# EAGLE design RobotBoard4 (EAGLE 6.5.0)
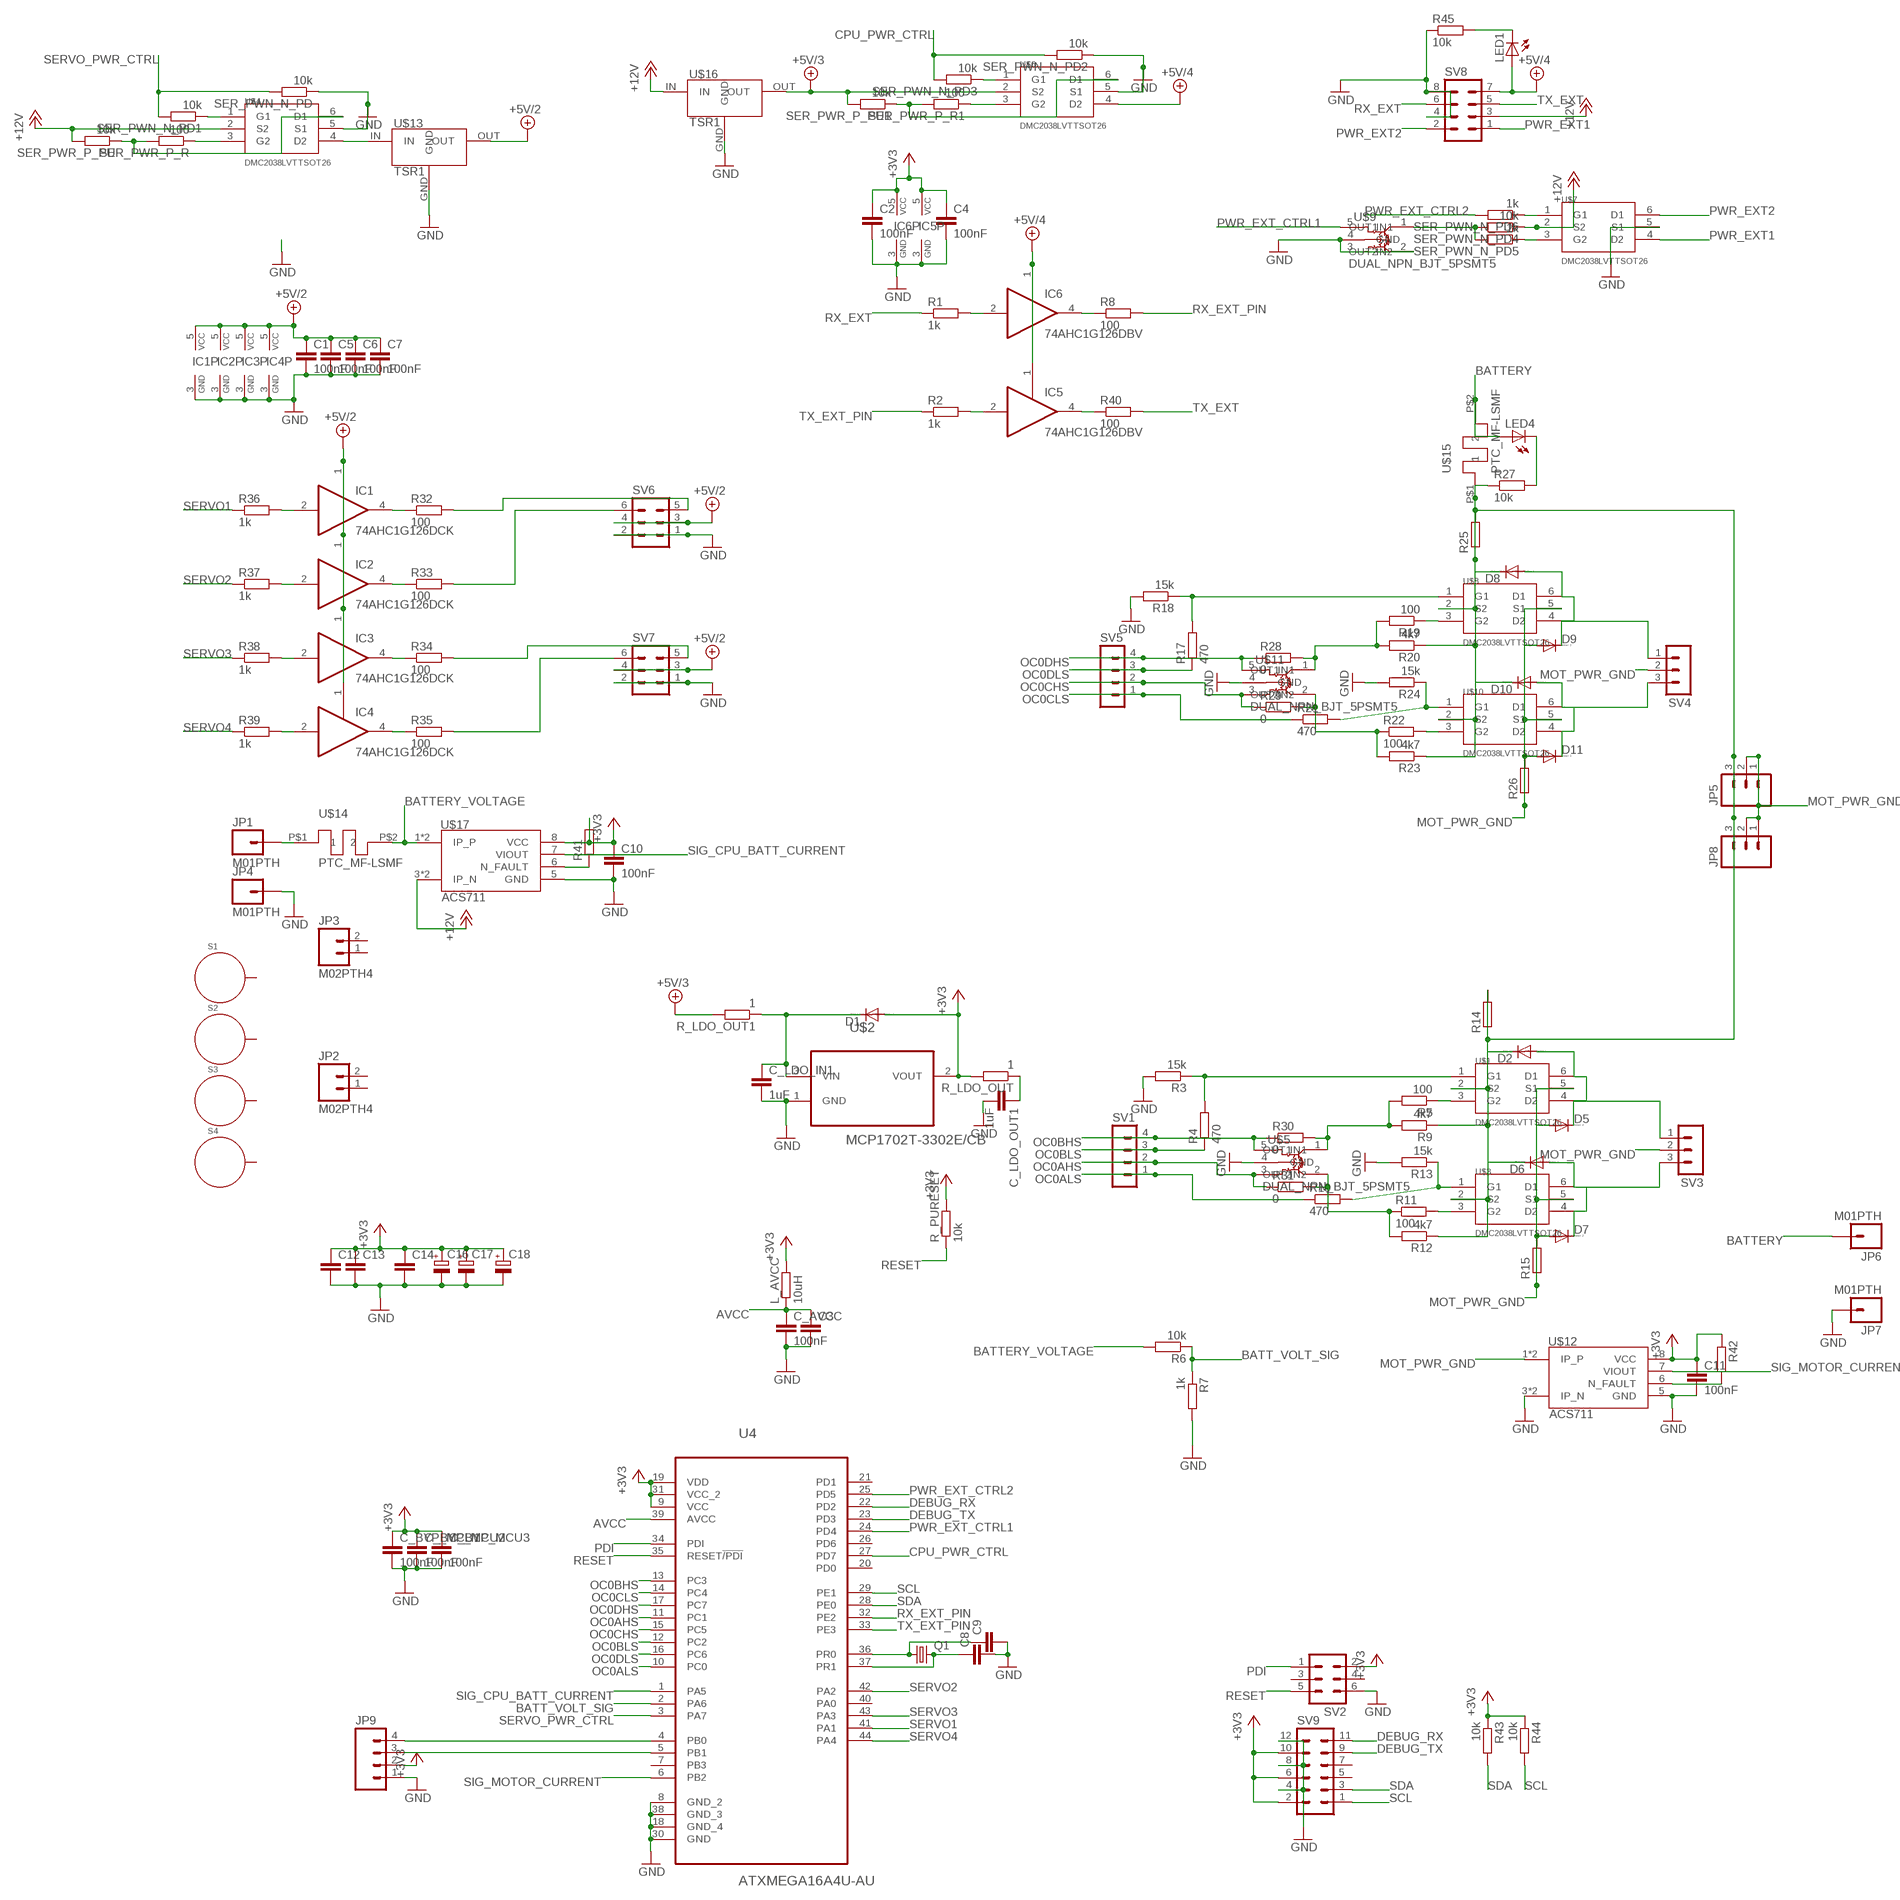
[diagram p0: schematic, sheet 1]

## Parts
C1  100nF  C-EUC0603  [C0603]
C2  100nF  C-EUC0603K  [C0603K]
C3  C-EUC1206K  [C1206K]
C4  100nF  C-EUC0603K  [C0603K]
C5  100nF  C-EUC0603  [C0603]
C6  100nF  C-EUC0603  [C0603]
C7  100nF  C-EUC0603  [C0603]
C8  C-EUC0603K  [C0603K]
C9  C-EUC0603K  [C0603K]
C10  100nF  C-EUC0603K  [C0603K]
C11  100nF  C-EUC0603K  [C0603K]
C12  C-EUC0805K  [C0805K]
C13  C-EUC0805K  [C0805K]
C14  C-EUC1210  [C1210]
C16  CPOL-EUE2.5-6  [E2,5-6]
C17  CPOL-EUE2.5-6  [E2,5-6]
C18  CPOL-EU153CLV-0505  [153CLV-0505]
C_AVCC  100nF  C-EUC0603  [C0603]
C_BYP_MCU1  100nF  C-EUC0603  [C0603]
C_BYP_MCU2  100nF  C-EUC0603  [C0603]
C_BYP_MCU3  100nF  C-EUC0603  [C0603]
C_LDO_IN1  1uF  C-EUC0805  [C0805]
C_LDO_OUT1  1uF  C-EUC0805  [C0805]
D1  DIODE-SOD523  [SOD523]
D2  DIODE-SOD123  [SOD123]
D5  DIODE-SOD123  [SOD123]
D6  DIODE-SOD123  [SOD123]
D7  DIODE-SOD123  [SOD123]
D8  DIODE-SOD123  [SOD123]
D9  DIODE-SOD123  [SOD123]
D10  DIODE-SOD123  [SOD123]
D11  DIODE-SOD123  [SOD123]
IC1  74AHC1G126DCK  [SC70-5]
IC2  74AHC1G126DCK  [SC70-5]
IC3  74AHC1G126DCK  [SC70-5]
IC4  74AHC1G126DCK  [SC70-5]
IC5  74AHC1G126DBV  [SOT23-5]
IC6  74AHC1G126DBV  [SOT23-5]
JP1  M01PTH  [1X01]
JP2  M02PTH4  [1X02_XTRA_BIG]
JP3  M02PTH4  [1X02_XTRA_BIG]
JP4  M01PTH  [1X01]
JP5  M03PTH  [1X03]
JP6  M01PTH  [1X01]
JP7  M01PTH  [1X01]
JP8  M03PTH  [1X03]
JP9  M04PTH  [1X04]
L_AVCC  10uH  R-EU_R0805  [R0805]
LED1  LEDSML0603  [SML0603]
LED4  LEDSML0603  [SML0603]
Q1  CRYSTALHC49S  [HC49/S]
R1  1k  R-EU_R0603  [R0603]
R2  1k  R-EU_R0603  [R0603]
R3  15k  R-EU_R0603  [R0603]
R4  470  R-EU_R0603  [R0603]
R5  100  R-EU_R0603  [R0603]
R6  10k  R-EU_R0603  [R0603]
R7  1k  R-EU_R0603  [R0603]
R8  100  R-EU_R0603  [R0603]
R9  4k7  R-EU_R0603  [R0603]
R10  470  R-EU_R0603  [R0603]
R11  100  R-EU_R0603  [R0603]
R12  4k7  R-EU_R0603  [R0603]
R13  15k  R-EU_R0603  [R0603]
R14  R-EU_0204/5  [0204/5]
R15  R-EU_0204/5  [0204/5]
R17  470  R-EU_R0603  [R0603]
R18  15k  R-EU_R0603  [R0603]
R19  100  R-EU_R0603  [R0603]
R20  4k7  R-EU_R0603  [R0603]
R21  470  R-EU_R0603  [R0603]
R22  100  R-EU_R0603  [R0603]
R23  4k7  R-EU_R0603  [R0603]
R24  15k  R-EU_R0603  [R0603]
R25  R-EU_0204/5  [0204/5]
R26  R-EU_0204/5  [0204/5]
R27  10k  R-EU_R0603  [R0603]
R28  0  R-EU_R0603  [R0603]
R29  0  R-EU_R0603  [R0603]
R30  0  R-EU_R0603  [R0603]
R31  0  R-EU_R0603  [R0603]
R32  100  R-EU_R0603  [R0603]
R33  100  R-EU_R0603  [R0603]
R34  100  R-EU_R0603  [R0603]
R35  100  R-EU_R0603  [R0603]
R36  1k  R-EU_R0603  [R0603]
R37  1k  R-EU_R0603  [R0603]
R38  1k  R-EU_R0603  [R0603]
R39  1k  R-EU_R0603  [R0603]
R40  100  R-EU_R0603  [R0603]
R41  R-EU_R0603  [R0603]
R42  R-EU_R0603  [R0603]
R43  10k  R-EU_R0603  [R0603]
R44  10k  R-EU_R0603  [R0603]
R45  10k  R-EU_R0603  [R0603]
R_LDO_OUT  1  R-EU_R0603  [R0603]
R_LDO_OUT1  1  R-EU_R0603  [R0603]
R_PURESET  10k  R-EU_R0603  [R0603]
S1  STANDOFF_ELECTRICAL  [STANDOFF-ELECTRICAL]
S2  STANDOFF_ELECTRICAL  [STANDOFF-ELECTRICAL]
S3  STANDOFF_ELECTRICAL  [STANDOFF-ELECTRICAL]
S4  STANDOFF_ELECTRICAL  [STANDOFF-ELECTRICAL]
SER_PWN_N_PD  10k  R-EU_R0603  [R0603]
SER_PWN_N_PD1  10k  R-EU_R0603  [R0603]
SER_PWN_N_PD2  10k  R-EU_R0603  [R0603]
SER_PWN_N_PD3  10k  R-EU_R0603  [R0603]
SER_PWN_N_PD4  10k  R-EU_R0603  [R0603]
SER_PWN_N_PD5  1k  R-EU_R0603  [R0603]
SER_PWN_N_PD6  1k  R-EU_R0603  [R0603]
SER_PWR_P_PU  10k  R-EU_R0603  [R0603]
SER_PWR_P_PU1  10k  R-EU_R0603  [R0603]
SER_PWR_P_R  100  R-EU_R0603  [R0603]
SER_PWR_P_R1  100  R-EU_R0603  [R0603]
SV1  MA04-1  [MA04-1]
SV2  MA03-2  [MA03-2]
SV3  MA03-1  [MA03-1]
SV4  MA03-1  [MA03-1]
SV5  MA04-1  [MA04-1]
SV6  MA03-2  [MA03-2]
SV7  MA03-2  [MA03-2]
SV8  MA04-2  [MA04-2]
SV9  MA06-2  [MA06-2]
U4  ATXMEGA16A4U-AU  [QFP80P1200X1200X120-44N]
U$1  DMC2038LVTTSOT26  [TSOT26]
U$2  MCP1702T-3302E/CB  [SOT95P255X145-3N]
U$3  DMC2038LVTTSOT26  [TSOT26]
U$4  DMC2038LVTTSOT26  [TSOT26]
U$5  DUAL_NPN_BJT_5PSMT5  [SC-74A]
U$6  DMC2038LVTTSOT26  [TSOT26]
U$7  DMC2038LVTTSOT26  [TSOT26]
U$8  DMC2038LVTTSOT26  [TSOT26]
U$9  DUAL_NPN_BJT_5PSMT5  [SC-74A]
U$10  DMC2038LVTTSOT26  [TSOT26]
U$11  DUAL_NPN_BJT_5PSMT5  [SC-74A]
U$12  ACS711  [SO08]
U$13  TSR1  [TSR-1]
U$14  PTC_MF-LSMF  [PTC_FUSE_BOURNS]
U$15  PTC_MF-LSMF  [PTC_FUSE_BOURNS]
U$16  TSR1  [TSR-1]
U$17  ACS711  [SO08]

## Nets
+3V3: C2.1 C4.1 C10.1 C11.1 C12.1 C13.1 C14.1 C16.+ C17.+ C18.+ C_BYP_MCU1.1 C_BYP_MCU2.1 C_BYP_MCU3.1 D1.A IC5.5(VCC) IC6.5(VCC) JP9.2 L_AVCC.2 R41.2 R42.1 R43.1 R44.1 R_LDO_OUT.2 R_PURESET.2 SV2.2 SV9.2 SV9.6 SV9.10 U4.9(VCC) U4.19(VDD) U4.31(VCC_2) U$2.2(VOUT) U$12.8(VCC) U$17.8(VCC)
+5V/2: C1.1 C5.1 C6.1 C7.1 IC1.1(OE) IC1.5(VCC) IC2.1(OE) IC2.5(VCC) IC3.1(OE) IC3.5(VCC) IC4.1(OE) IC4.5(VCC) SV6.3 SV6.4 SV7.3 SV7.4 U$13.OUT
+5V/3: R_LDO_OUT1.2 SER_PWR_P_PU1.2 U$6.2(S2) U$16.OUT
+5V/4: IC5.1(OE) IC6.1(OE) LED1.A SV8.7 U$6.4(D2)
+12V: SER_PWN_N_PD4.1 SER_PWR_P_PU.2 SV8.3 U$4.2(S2) U$7.2(S2) U$16.IN U$17.3(IP_N) U$17.4(IP_N)
AVCC: C3.1 C_AVCC.1 L_AVCC.1 U4.39(AVCC)
BATT_VOLT_SIG: R6.1 R7.1 U4.2(PA6)
BATTERY: JP6.1 LED4.A U$15.P$2
BATTERY_VOLTAGE: R6.2 U$14.P$2 U$17.1(IP_P) U$17.2(IP_P)
CPU_PWR_CTRL: SER_PWN_N_PD2.2 SER_PWN_N_PD3.2 U4.27(PD7)
DEBUG_RX: SV9.11 U4.22(PD2)
DEBUG_TX: SV9.9 U4.23(PD3)
GND: C1.2 C2.2 C3.2 C4.2 C5.2 C6.2 C7.2 C8.2 C9.2 C10.2 C11.2 C12.2 C13.2 C14.2 C16.- C17.- C18.- C_AVCC.2 C_BYP_MCU1.2 C_BYP_MCU2.2 C_BYP_MCU3.2 C_LDO_IN1.2 C_LDO_OUT1.2 IC1.3(GND) IC2.3(GND) IC3.3(GND) IC4.3(GND) IC5.3(GND) IC6.3(GND) JP4.1 JP7.1 JP9.1 R3.2 R7.2 R13.2 R18.2 R24.2 R45.1 SER_PWN_N_PD2.1 SER_PWN_N_PD.1 SV2.6 SV6.1 SV6.2 SV7.1 SV7.2 SV8.4 SV8.8 SV9.4 SV9.8 SV9.12 U4.8(GND_2) U4.18(GND_4) U4.30(GND) U4.38(GND_3) U$2.1(GND) U$4.5(S1) U$5.4(GND) U$6.5(S1) U$7.5(S1) U$9.2(OUT2) U$9.3(IN2) U$9.4(GND) U$11.4(GND) U$12.3(IP_N) U$12.4(IP_N) U$12.5(GND) U$13.GND U$16.GND U$17.5(GND)
MOT_PWR_GND: D5.A D7.A D9.A D11.A JP5.1 JP5.2 JP8.1 JP8.2 R15.1 R15.2 R26.1 R26.2 SV3.2 SV4.2 U$1.5(S1) U$3.5(S1) U$8.5(S1) U$10.5(S1) U$12.1(IP_P) U$12.2(IP_P)
N$1: R5.2 R9.2 R30.2 U$5.1(OUT1)
N$2: SER_PWR_P_PU.1 SER_PWR_P_R.2 U$4.6(D1)
N$3: SER_PWR_P_R.1 U$4.3(G2)
N$4: C_LDO_OUT1.1 R_LDO_OUT.1
N$5: JP9.4 U4.4(PB0)
N$6: JP1.1 U$14.P$1
N$7: SER_PWN_N_PD1.1 U$4.1(G1)
N$8: C_LDO_IN1.1 D1.C R_LDO_OUT1.1 U$2.3(VIN)
N$9: SER_PWR_P_PU1.1 SER_PWR_P_R1.2 U$6.6(D1)
N$10: SER_PWR_P_R1.1 U$6.3(G2)
N$11: R11.1 R12.2 R31.2 U$5.2(OUT2)
N$12: R3.1 R4.2 U$1.1(G1)
N$13: R5.1 U$1.3(G2)
N$14: R10.2 R13.1 U$3.1(G1)
N$15: R11.2 U$3.3(G2)
N$16: JP9.3 U4.5(PB1)
N$17: D2.A D5.C SV3.1 U$1.4(D2) U$1.6(D1)
N$18: IC1.4(O) R32.1
N$19: D6.A D7.C SV3.3 U$3.4(D2) U$3.6(D1)
N$20: R17.2 R18.1 U$8.1(G1)
N$21: R19.1 U$8.3(G2)
N$22: R19.2 R20.2 R28.2 U$11.1(OUT1)
N$23: D2.C D6.C D8.C D10.C JP5.3 JP8.3 R9.1 R12.1 R14.1 R14.2 R20.1 R23.1 R25.1 R25.2 R27.1 U$1.2(S2) U$3.2(S2) U$8.2(S2) U$10.2(S2) U$15.P$1
N$24: IC6.2(I) R1.2
N$25: R22.1 R23.2 R29.2 U$11.2(OUT2)
N$26: R21.2 R24.1 U$10.1(G1)
N$27: R22.2 U$10.3(G2)
N$28: LED4.C R27.2
N$29: D8.A D9.C SV4.1 U$8.4(D2) U$8.6(D1)
N$30: D10.A D11.C SV4.3 U$10.4(D2) U$10.6(D1)
N$31: IC2.4(O) R33.1
N$32: IC3.4(O) R34.1
N$33: IC4.4(O) R35.1
N$34: IC1.2(I) R36.2
N$35: IC2.2(I) R37.2
N$36: IC3.2(I) R38.2
N$37: IC4.2(I) R39.2
N$38: R32.2 SV6.5
N$39: R33.2 SV6.6
N$40: R34.2 SV7.5
N$41: R35.2 SV7.6
N$42: SER_PWN_N_PD3.1 U$6.1(G1)
N$43: U$4.4(D2) U$13.IN
N$44: C9.1 Q1.1 U4.36(PR0)
N$45: C8.1 Q1.2 U4.37(PR1)
N$46: IC5.2(I) R2.2
N$47: IC5.4(O) R40.1
N$48: IC6.4(O) R8.1
N$49: R42.2 U$12.6(N_FAULT)
N$50: SER_PWN_N_PD5.1 U$7.3(G2)
N$51: SER_PWN_N_PD4.2 SER_PWN_N_PD5.2 U$9.1(OUT1)
N$52: SER_PWN_N_PD6.1 U$7.1(G1)
N$53: LED1.C R45.2
N$54: R41.1 U$17.6(N_FAULT)
OC0AHS: R31.1 SV1.2 U4.11(PC1) U$5.3(IN2)
OC0ALS: R10.1 SV1.1 U4.10(PC0)
OC0BHS: R30.1 SV1.4 U4.13(PC3) U$5.5(IN1)
OC0BLS: R4.1 SV1.3 U4.12(PC2)
OC0CHS: R29.1 SV5.2 U4.15(PC5) U$11.3(IN2)
OC0CLS: R21.1 SV5.1 U4.14(PC4)
OC0DHS: R28.1 SV5.4 U4.17(PC7) U$11.5(IN1)
OC0DLS: R17.1 SV5.3 U4.16(PC6)
PDI: SV2.1 U4.34(PDI)
PWR_EXT1: SV8.1 U$7.4(D2)
PWR_EXT2: SV8.2 U$7.6(D1)
PWR_EXT_CTRL1: U4.24(PD4) U$9.5(IN1)
PWR_EXT_CTRL2: SER_PWN_N_PD6.2 U4.25(PD5)
RESET: R_PURESET.1 SV2.5 U4.35(RESET!/PDI)
RX_EXT: R1.1 SV8.6
RX_EXT_PIN: R8.2 U4.32(PE2)
SCL: R44.2 SV9.1 U4.29(PE1)
SDA: R43.2 SV9.3 U4.28(PE0)
SERVO1: R36.1 U4.41(PA1)
SERVO2: R37.1 U4.42(PA2)
SERVO3: R38.1 U4.43(PA3)
SERVO4: R39.1 U4.44(PA4)
SERVO_PWR_CTRL: SER_PWN_N_PD1.2 SER_PWN_N_PD.2 U4.3(PA7)
SIG_CPU_BATT_CURRENT: U4.1(PA5) U$17.7(VIOUT)
SIG_MOTOR_CURRENT: U4.6(PB2) U$12.7(VIOUT)
TX_EXT: R40.2 SV8.5
TX_EXT_PIN: R2.1 U4.33(PE3)
Unconnected: JP2.1 JP2.2 JP3.1 JP3.2 S1.P1 S2.P1 S3.P1 S4.P1 SV2.3 SV2.4 SV9.5 SV9.7 U4.7(PB3) U4.20(PD0) U4.21(PD1) U4.26(PD6) U4.40(PA0)

## Library data of the parts
C1-C14 C_AVCC C_BYP_MCU1-C_BYP_MCU3 C_LDO_IN1 C_LDO_OUT1 = resistor:C-EU: CAPACITOR, European symbol
C16-C18 = resistor:CPOL-EU: POLARIZED CAPACITOR, European symbol
D1 D2 D5-D11 = diode:DIODE-: DIODE
IC1-IC6 = 74xx-little-us:74*1G126: Single Bus Buffer Gate With 3-State Outputs
JP1 JP4 JP6 JP7 = SparkFun-Connectors:M01: Header 1 Standard 1-pin 0.1" header. Use with straight break away headers (SKU : PRT-00116), right angle break away headers (PRT-00553), swiss pins (PRT-00743), machine pins (PRT-00117), and female headers (PRT-00115).
JP2 JP3 = SparkFun-Connectors:M02: Standard 2-pin 0.1" header. Use with - straight break away headers ( PRT-00116) - right angle break away headers (PRT-00553) - swiss pins (PRT-00743) - machine pins (PRT-00117) - female headers (PRT-00115) Molex polarized connector foot print use with: PRT-08233 with associated crimp pins and housings. 2.54_SCREWTERM for use with PRT-10571. 3.5mm Screw Terminal footprints for PRT-08084 5mm Screw Terminal footprints for use with PRT-08433
JP5 JP8 = SparkFun-Connectors:M03: Header 3 Standard 3-pin 0.1" header. Use with straight break away headers (SKU : PRT-00116), right angle break away headers (PRT-00553), swiss pins (PRT-00743), machine pins (PRT-00117), and female headers (PRT-00115). Molex polarized connector foot print use with SKU : PRT-08232 with associated crimp pins and housings.
JP9 = SparkFun-Connectors:M04: Header 4 Standard 4-pin 0.1" header. Use with straight break away headers (SKU : PRT-00116), right angle break away headers (PRT-00553), swiss pins (PRT-00743), machine pins (PRT-00117), and female headers (PRT-00115). Molex polarized connector foot print use with SKU : PRT-08231 with associated crimp pins and housings. 1MM SMD Version SKU: PRT-10208
L_AVCC R1-R15 R17-R45 R_LDO_OUT R_LDO_OUT1 R_PURESET SER_PWN_N_PD SER_PWN_N_PD1-SER_PWN_N_PD6 SER_PWR_P_PU SER_PWR_P_PU1 SER_PWR_P_R SER_PWR_P_R1 = resistor:R-EU_: RESISTOR, European symbol
LED1 LED4 = led:LED: LED OSRAM: - CHIPLED LG R971, LG N971, LY N971, LG Q971, LY Q971, LO R971, LY R971 LH N974, LH R974 LS Q976, LO Q976, LY Q976 LO Q996 - Hyper CHIPLED LW Q18S LB Q993, LB Q99A, LB R99A - SideLED LS A670, LO A670, LY A670, LG A670, LP A670 LB A673, LV A673, LT A673, LW A673 LH A674 LY A675 LS A676, LA A676, LO A676, LY A676, LW A676 LS A679, LY A679, LG A679 - Hyper Micro SIDELED® LS Y876, LA Y876, LO Y876, LY Y876 LT Y87S - SmartLED LW L88C, LW L88S LB L89C, LB L89S, LG L890 LS L89K, LO L89K, LY L89K LS L896, LA L896, LO L896, LY L896 - TOPLED LS T670, LO T670, LY T670, LG T670, LP T670 LSG T670, LSP T670, LSY T670, LOP T670, LYG T670 LG T671, LOG T671, LSG T671 LB T673, LV T673, LT T673, LW T673 LH T674 LS T676, LA T676, LO T676, LY T676, LB T676, LH T676, LSB T676, LW T676 LB T67C, LV T67C, LT T67C, LS T67K, LO T67K, LY T67K, LW E67C LS E67B, LA E67B, LO E67B, LY E67B, LB E67C, LV E67C, LT E67C LW T67C LS T679, LY T679, LG T679 LS T770, LO T770, LY T770, LG T770, LP T770 LB T773, LV T773, LT T773, LW T773 LH T774 LS E675, LA E675, LY E675, LS T675 LS T776, LA T776, LO T776, LY T776, LB T776 LHGB T686 LT T68C, LB T68C - Hyper Mini TOPLED® LB M676 - Mini TOPLED Santana® LG M470 LS M47K, LO M47K, LY M47K Source: http://www.osram.convergy.de LUXEON: - LUMILED® LXK2-PW12-R00, LXK2-PW12-S00, LXK2-PW14-U00, LXK2-PW14-V00 LXK2-PM12-R00, LXK2-PM12-S00, LXK2-PM14-U00 LXK2-PE12-Q00, LXK2-PE12-R00, LXK2-PE12-S00, LXK2-PE14-T00, LXK2-PE14-U00 LXK2-PB12-K00, LXK2-PB12-L00, LXK2-PB12-M00, LXK2-PB14-N00, LXK2-PB14-P00, LXK2-PB14-Q00 LXK2-PR12-L00, LXK2-PR12-M00, LXK2-PR14-Q00, LXK2-PR14-R00 LXK2-PD12-Q00, LXK2-PD12-R00, LXK2-PD12-S00 LXK2-PH12-R00, LXK2-PH12-S00 LXK2-PL12-P00, LXK2-PL12-Q00, LXK2-PL12-R00 Source: www.luxeon.com KINGBRIGHT: KA-3528ASYC Source: www.kingbright.com
Q1 = crystal:CRYSTAL: CRYSTAL; OC_FARNELL: 1667008; OC_NEWARK: unknown
S1-S4 = SparkFun-Electromechanical:STANDOFF_ELECTRICAL: A standoff intended to be an electrically connected point. Pad size and stop size allow for a #4 Phillips pan screw head to make a solid connection to the board.
SV1 SV5 = con-lstb:MA04-1: PIN HEADER; OC_FARNELL: unknown; OC_NEWARK: unknown
SV2 SV6 SV7 = con-lstb:MA03-2: PIN HEADER; OC_FARNELL: unknown; OC_NEWARK: unknown
SV3 SV4 = con-lstb:MA03-1: PIN HEADER; OC_FARNELL: unknown; OC_NEWARK: unknown
SV8 = con-lstb:MA04-2: PIN HEADER; OC_FARNELL: unknown; OC_NEWARK: unknown
SV9 = con-lstb:MA06-2: PIN HEADER; OC_FARNELL: unknown; OC_NEWARK: unknown
U4 = jmsSwitches:ATXMEGA16A4U-AU: 8/16-bit Atmel XMEGA A4U Microcontroller; MPN: ATXMEGA16A4U-AU; OC_FARNELL: 2066301; OC_NEWARK: 68T3903; PACKAGE: TQFP-44; SUPPLIER: ATMEL
U$1 U$3 U$4 U$6-U$8 U$10 = jmsSwitches:DMC2038LVT
U$2 = jmsSwitches:MCP1702T-3302E/CB: 250 mA Low Quiescent Current LDO Regulator; MPN: MCP1702T-3302E/CB; OC_FARNELL: 1331490; OC_NEWARK: 84R5179; PACKAGE: SOT23-3; SUPPLIER: Microchip
U$5 U$9 U$11 = jmsSwitches:DUAL_NPN_BJT_5P
U$12 U$17 = jmsSwitches:ACS711: Current sensor, hall effect, 12.5A or 25A. Withstands 5x overcurrent. Fault pin indicates overcurrent. Isolated from current pins up to 100V. Current measure path resistance 1.2mOhm typical.
U$13 U$16 = jmsSwitches:TSR1: Switching regulator, integrated. No need for external components unless Vin is more than 32V. Then use a 22uF 50V capacitor. Max output capacitive load 470uF. Max ambient temperature 60degC. Max Iout 1A. Min Vin 6.5V for 5V out variant. See datasheet for the others.
U$14 U$15 = jmsSwitches:PTC_MF-LSMF: Resettable fuse, PTC. Bourns MF-LSMF series. Up to 33V and 40A. Farnell: 2057923

## Board
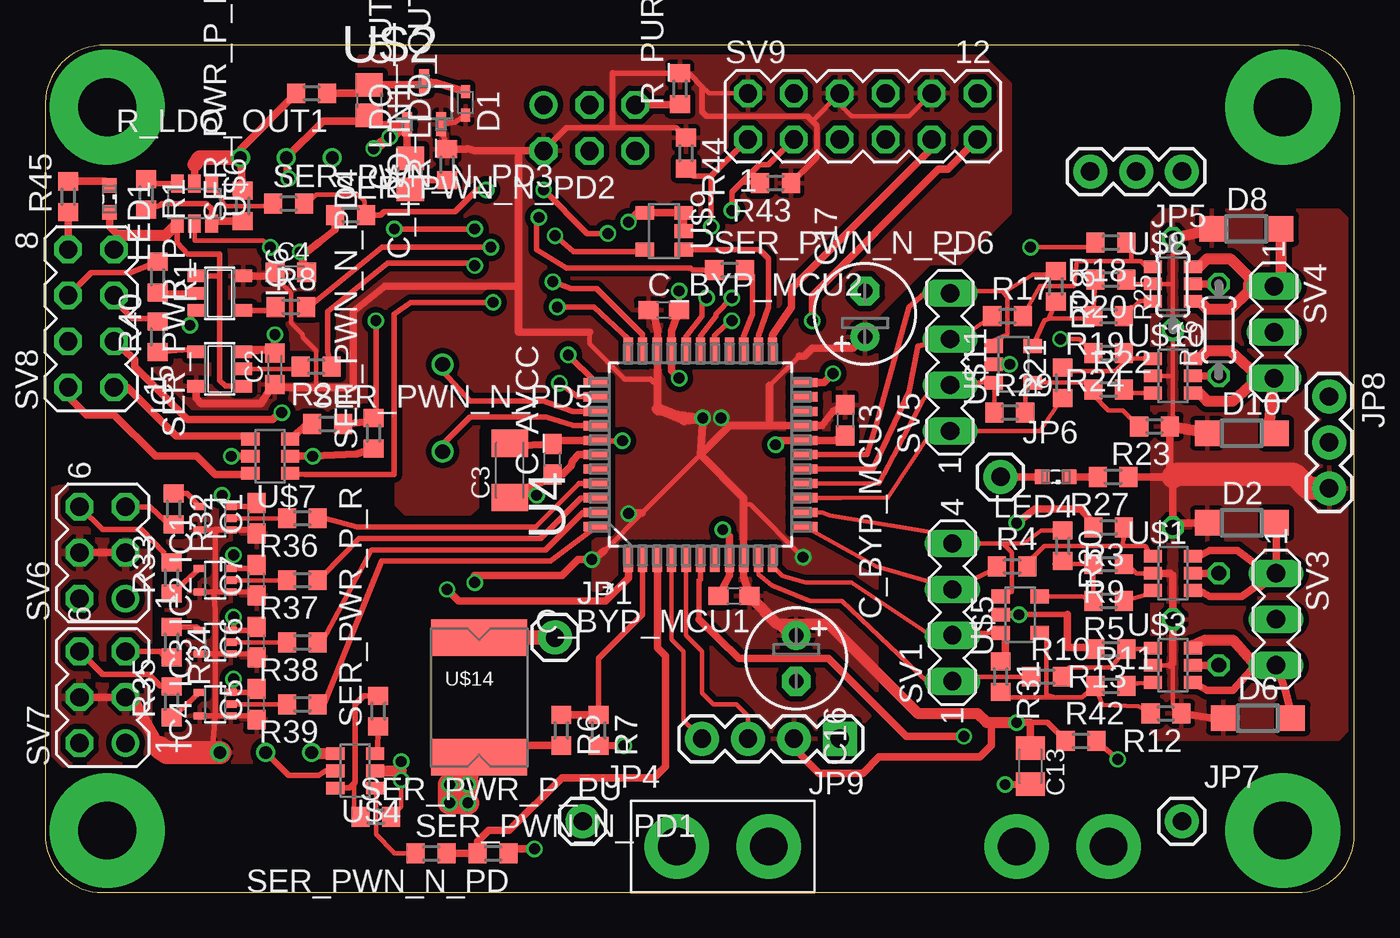
[diagram p1: board, top side]
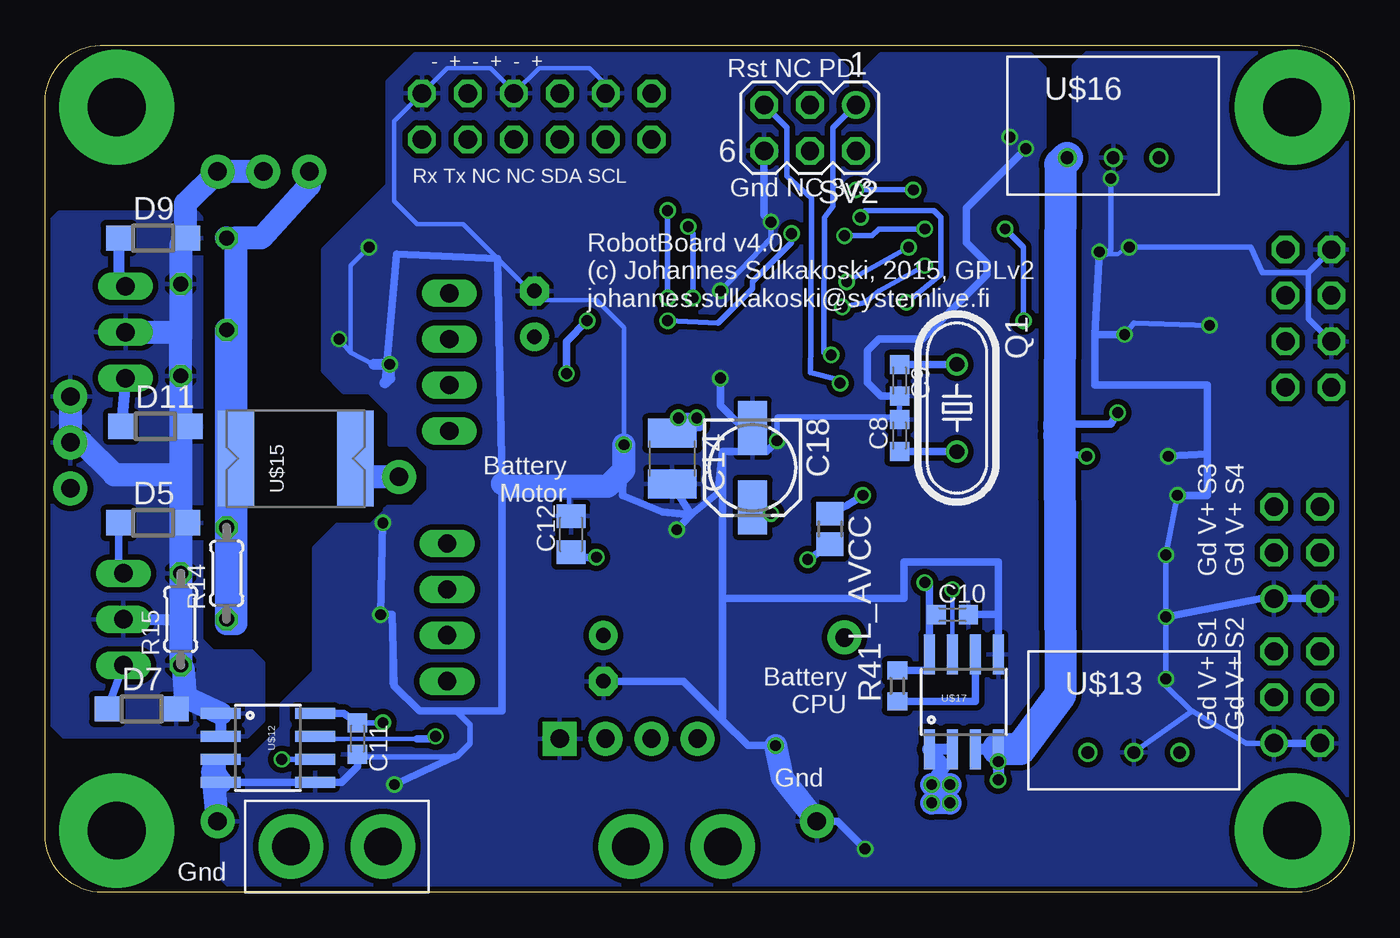
[diagram p2: board, bottom side, seen from below]

Size 72.39 x 46.86 mm. Coordinates in mm from the lower left corner, seen from the top.
Outline: 0,43.69 0,3.17 arc90 3.17,0 69.22,0 arc90 72.39,3.17 72.39,43.69 arc90 69.34,46.86 3.3,46.86 arc90 0,43.69
Copper layers (1*2*15*16): Top 0.035mm / dielectric 0.2mm / layer 2 0.0175mm / dielectric 1.1mm / layer 15 0.0175mm / dielectric 0.2mm / Bottom 0.035mm
Design rules "SeeedStudio_DRU_no_angle_20130527": minimum track width 6mil, minimum drill 12mil, track to track 6mil, track to pad 6mil, pad to pad 6mil, via to via 6mil, smd to smd 0mil, copper to edge 10mil, drill to drill 10mil, minimum pad ring 6mil, minimum via ring 6mil, stop-mask expansion 2mil, vias tented up to drill 25mil, thermal gap 10mil

### Footprints (pad centres in the part's own frame; a part is rotated, then mirrored left to right if it is on the bottom)
C0603 = smd 1.1 x 1: 1 -0.85,0; 2 0.85,0
C0603K = smd 1.05 x 1.08: 1 -0.875,0; 2 0.875,0
C1206K = smd 1.5 x 2: 1 -1.5,0; 2 1.5,0
C0805K = smd 1.3 x 1.6: 1 -1,0; 2 1,0
C1210 = smd 1.6 x 2.7: 1 -1.4,0; 2 1.4,0
E2,5-6 = drill 0.813 pad 1.6: + -1.27,0 | drill 0.813 pad 1.6 octagon: - 1.27,0
153CLV-0505 = smd 3 x 1.6: + 2.2,0; - -2.2,0
C0805 = smd 1.3 x 1.5: 1 -0.85,0; 2 0.85,0
SOD523 = smd 0.7 x 0.5: A 0.7,0; C -0.6,0
SOD123 = smd 1.4 x 1.4: A 1.9,0; C -1.9,0
SC70-5 = smd 0.4 x 0.7: 1 -0.65,-0.85; 2 0,-0.85; 3 0.65,-0.85; 4 0.65,0.85; 5 -0.65,0.85
SOT23-5 = smd 0.69 x 0.99: 1 -0.95,-1.29; 2 0,-1.29; 3 0.95,-1.29; 4 0.95,1.3; 5 -0.95,1.3
1X01 = drill 1.016 pad 1.88: 1 0,0
1X02_XTRA_BIG = drill 2.057 pad 3.556: 1 -2.54,0; 2 2.54,0
1X03 = drill 1.016 pad 1.88: 1 0,0; 2 2.54,0; 3 5.08,0
1X04 = drill 1.016 pad 1.88 square: 1 0,0 | drill 1.016 pad 1.88: 2 2.54,0; 3 5.08,0; 4 7.62,0
R0805 = smd 1.3 x 1.5: 1 -0.85,0; 2 0.85,0
SML0603 = smd 0.8 x 0.8: A 0.75,0; C -0.75,0
HC49/S = drill 0.813: 1 -2.413,0; 2 2.413,0
R0603 = smd 1 x 1.1: 1 -0.85,0; 2 0.85,0
0204/5 = drill 0.813 octagon: 1 -2.54,0; 2 2.54,0
STANDOFF-ELECTRICAL = drill 3.2 pad 6.35: P1 0,0
MA04-1 = drill 1.016 long: 1 -3.81,0; 2 -1.27,0; 3 1.27,0; 4 3.81,0
MA03-2 = drill 1.016: 1 -2.54,-1.27 | drill 1.016 octagon: 2 -2.54,1.27; 3 0,-1.27; 4 0,1.27; 5 2.54,-1.27; 6 2.54,1.27
MA03-1 = drill 1.016 long: 1 -2.54,0; 2 0,0; 3 2.54,0
MA04-2 = drill 1.016 octagon: 1 -3.81,-1.27; 2 -3.81,1.27; 3 -1.27,-1.27; 4 -1.27,1.27; 5 1.27,-1.27; 6 1.27,1.27; 7 3.81,-1.27; 8 3.81,1.27
MA06-2 = drill 1.016 octagon: 1 -6.35,-1.27; 2 -6.35,1.27; 3 -3.81,-1.27; 4 -3.81,1.27; 5 -1.27,-1.27; 6 -1.27,1.27; 7 1.27,-1.27; 8 1.27,1.27; 9 3.81,-1.27; 10 3.81,1.27; 11 6.35,-1.27; 12 6.35,1.27
QFP80P1200X1200X120-44N = smd 1.473 x 0.508: 1 -5.74,3.988; 2 -5.74,3.2; 3 -5.74,2.388; 4 -5.74,1.6; 5 -5.74,0.787; 6 -5.74,0; 7 -5.74,-0.787; 8 -5.74,-1.6; 9 -5.74,-2.388; 10 -5.74,-3.2; 11 -5.74,-3.988; 23 5.74,-3.988; 24 5.74,-3.2; 25 5.74,-2.388; 26 5.74,-1.6; 27 5.74,-0.787; 28 5.74,0; 29 5.74,0.787; 30 5.74,1.6; 31 5.74,2.388; 32 5.74,3.2; 33 5.74,3.988 | smd 0.508 x 1.473: 12 -3.988,-5.74; 13 -3.2,-5.74; 14 -2.388,-5.74; 15 -1.6,-5.74; 16 -0.787,-5.74; 17 0,-5.74; 18 0.787,-5.74; 19 1.6,-5.74; 20 2.388,-5.74; 21 3.2,-5.74; 22 3.988,-5.74; 34 3.988,5.74; 35 3.2,5.74; 36 2.388,5.74; 37 1.6,5.74; 38 0.787,5.74; 39 0,5.74; 40 -0.787,5.74; 41 -1.6,5.74; 42 -2.388,5.74; 43 -3.2,5.74; 44 -3.988,5.74
TSOT26 = smd 1 x 0.7: 1 -1.099,0.95; 2 -1.099,0; 3 -1.099,-0.95; 4 1.099,-0.95; 5 1.099,0; 6 1.099,0.95
SOT95P255X145-3N = smd 0.559 x 1.321: 1 -0.94,-1.194; 2 0.94,-1.194; 3 0,1.194
SC-74A = smd 0.762 x 1.016: 1 2.032,0; 2 0,0; 3 0,2.159; 4 1.016,2.159; 5 2.032,2.159
SO08 = smd 0.61 x 2.21: 1 -1.905,-2.616; 2 -0.635,-2.616; 3 0.635,-2.616; 4 1.905,-2.616; 5 1.905,2.616; 6 0.635,2.616; 7 -0.635,2.616; 8 -1.905,2.616
TSR-1 = drill 0.7: GND 0,0; IN -2.54,0; OUT 2.54,0
PTC_FUSE_BOURNS = smd 2.007 x 5.309: P$1 -3.302,0; P$2 3.302,0

### Placement (x,y rotation side)
C1  11.68,20.7 90 top
C2  12.7,28.96 90 top
C3  25.69,23.35 90 top
C4  13.59,34.29 0 top
C5  11.68,10.41 90 top
C6  11.68,13.84 90 top
C7  11.68,17.27 90 top
C8  25.15,25.27 90 bottom
C9  25.15,28.32 270 bottom
C10  22.23,15.37 0 bottom
C11  55.12,8.51 270 bottom
C12  43.31,19.81 90 bottom
C13  54.48,6.99 270 top
C14  37.72,24 270 bottom
C16  41.53,12.95 270 top
C17  45.34,32 90 top
C18  33.27,23.5 270 bottom
C_AVCC  28.05,23.97 90 top
C_BYP_MCU1  38.09,16.4 180 top
C_BYP_MCU2  34.2,32.22 0 top
C_BYP_MCU3  44.24,26.12 270 top
C_LDO_IN1  17.91,43.81 270 top
C_LDO_OUT1  20.19,39.75 90 top
D1  23.24,43.69 270 top
D2  66.17,20.45 0 top
D5  66.42,20.45 0 bottom
D6  67.06,9.65 0 top
D7  67.06,10.16 0 bottom
D8  66.42,36.7 0 top
D9  66.42,36.2 0 bottom
D10  66.17,25.4 0 top
D11  66.29,25.78 0 bottom
IC1  9.4,20.7 90 top
IC2  9.4,17.27 90 top
IC3  9.4,13.84 90 top
IC4  9.4,10.41 90 top
IC5  9.65,28.96 90 top
IC6  9.65,33.15 270 top
JP1  28.19,14.1 0 top
JP2  56.26,2.54 0 bottom
JP3  37.47,2.54 0 top
JP4  29.72,3.94 0 top
JP5  62.87,39.88 180 top
JP6  52.83,22.99 0 top
JP7  62.87,3.94 0 top
JP8  70.99,27.43 270 top
JP9  43.94,8.51 180 top
L_AVCC  28.99,20.11 270 bottom
LED1  3.56,38.35 270 top
LED4  55.88,22.99 180 top
Q1  21.97,26.8 270 bottom
R1  6.22,34.04 270 top
R2  14.99,29.08 180 top
R3  58.8,20.19 180 top
R4  53.47,18.03 0 top
R5  58.8,16.13 180 top
R6  28.54,8.98 270 top
R7  30.61,8.97 270 top
R8  13.59,32.38 0 top
R9  58.8,18.16 180 top
R10  55.37,11.94 0 top
R11  58.93,11.43 0 top
R12  61.98,9.91 180 top
R13  58.93,13.46 180 top
R14  62.36,17.65 90 bottom
R15  64.9,15.11 90 bottom
R17  53.21,31.88 0 top
R18  58.93,35.94 180 top
R19  58.8,31.88 180 top
R20  58.93,33.91 180 top
R21  56.26,28.19 90 top
R22  58.8,27.81 0 top
R23  61.34,25.78 180 top
R24  58.8,29.84 180 top
R25  62.36,33.66 90 top
R26  64.9,31.11 90 top
R27  59.05,22.99 180 top
R28  55.88,33.53 270 top
R29  53.34,26.54 0 top
R30  56.26,19.18 270 top
R31  52.83,11.94 270 top
R32  7.11,21.21 270 top
R33  6.99,17.4 90 top
R34  6.99,13.84 270 top
R35  6.99,10.54 90 top
R36  14.22,20.7 180 top
R37  14.22,17.27 180 top
R38  14.22,13.84 180 top
R39  14.22,10.41 180 top
R40  6.22,30.73 90 top
R41  25.27,11.43 90 bottom
R42  57.28,8.38 0 top
R43  40.39,39.24 180 top
R44  35.43,40.89 270 top
R45  1.27,38.48 90 top
R_LDO_OUT  22.23,40.26 90 top
R_LDO_OUT1  14.73,44.2 180 top
R_PURESET  35.1,44.46 90 top
S1  68.43,3.43 0 top
S2  3.43,3.43 0 top
S3  3.43,43.43 0 top
S4  68.43,43.43 0 top
SER_PWN_N_PD  24.77,2.16 180 top
SER_PWN_N_PD1  21.34,2.16 0 top
SER_PWN_N_PD2  16.89,37.47 0 top
SER_PWN_N_PD3  13.46,38.1 0 top
SER_PWN_N_PD4  18.16,25.4 90 top
SER_PWN_N_PD5  15.62,25.91 0 top
SER_PWN_N_PD6  37.85,34.42 0 top
SER_PWR_P_PU  18.29,4.19 0 top
SER_PWR_P_PU1  10.92,37.97 90 top
SER_PWR_P_R  18.41,10.03 90 top
SER_PWR_P_R1  5.59,38.61 270 top
SV1  50.16,15.49 90 top
SV2  30.1,42.29 180 bottom
SV3  68.07,15.11 270 top
SV4  67.94,30.99 270 top
SV5  50.04,29.34 90 top
SV6  3.17,18.8 90 top
SV7  3.17,10.79 90 top
SV8  2.54,31.75 90 top
SV9  45.21,42.93 0 top
U4  36.24,24.22 90 top
U$1  62.36,17.65 0 top
U$2  20.95,43.69 0 top
U$3  62.36,12.57 0 top
U$4  17.14,6.73 180 top
U$5  54.99,14.35 90 top
U$6  8.26,38.1 270 top
U$7  12.45,24.13 180 top
U$8  62.36,33.66 0 top
U$9  33.15,37.59 270 top
U$10  62.36,28.57 0 top
U$11  54.61,28.19 90 top
U$12  60.07,8 270 bottom
U$13  12.19,7.75 0 bottom
U$14  24,10.79 270 top
U$15  58.55,24 0 bottom
U$16  13.34,40.64 0 bottom
U$17  21.59,10.54 0 bottom

### Tracks (layer width: path | path; a pad name or v marks a point on that pad's centre or on a via)
+3V3  (via drill 0.6)
  Top 0.254: 41.7,29.68 40.05,28.03 | 30.9,18.89 31.03,19.01 33,20.98 36.23,24.22 | 30.1,30.99 30.1,30.36 32.04,28.41 | C4.1 12.71,34.02 13.59,33.15 13.59,31.5 14.22,30.86 14.22,30.73 14.99,29.97 14.99,27.94 | 36.32,44.58 36.7,44.2 SV9.2 | 42.42,42.67 SV9.6 43.94,43.56 44.58,42.93 47.75,42.93 SV9.10 | v41.91,18.54 38.99,21.46 38.62,21.46
  Top 0.305: R_LDO_OUT.2 21.89,42.38 U$2.2 22.66,42.61 D1.A | 32.04,28.41 33.47,28.41 33.85,28.03 | R42.1 55.41,9.4 v53.72,9.4 | SV2.2 28.83,42.29 31.37,42.29 | R43.1 42.67,40.68 42.67,42.42 42.42,42.67 42.16,42.93 36.58,42.93 36.32,43.18 36.32,44.58 35.65,45.25 R_PURESET.2 31.4,45.3 31.37,45.34 31.37,42.29 | R44.1 34.89,42.29 31.37,42.29
  Top 0.406: 36.23,24.22 v36.36,26.25 33.85,26.61 33.85,26.76 33.85,28.03 U4.31 33.85,31.09 33.7,31.84 33.61,32.18 C_BYP_MCU2.1 | 36.23,24.22 38.62,21.83 38.62,21.46 U4.9 38.62,17.48 C_BYP_MCU1.1 | 40.05,25.82 U4.19 42.95,25.82 43.6,26.63 C_BYP_MCU3.1 | 40.05,25.82 37.84,25.82 36.23,24.22 | 40.05,28.03 40.05,25.82 | R_LDO_OUT.2 23.28,41.11 23.37,41.15 23.75,41.02 26.16,41.02 | 26.16,41.02 26.16,33.53 | 30.1,30.99 26.16,30.99 26.16,33.53 | SV2.2 26.16,41.02 | 8.26,28.13 IC5.5 8.35,27.34 8.64,27.05 11.94,27.05 12.32,27.69 12.45,27.95 C2.1 12.7,27.94 14.99,27.94 17.02,27.94 17.02,32.13 18.8,33.53 26.16,33.53 | IC6.5 12.59,34.1 C4.1 | 30.9,18.89 30.43,18.54 v30.23,18.41 29.46,18.41 28.57,17.53 23.75,17.53 v23.75,17.14 | C17.+ 44.7,30.1 42.42,30.1 42,29.68 41.7,29.68 | v32.26,20.95 32.28,20.98 33,20.98 | C13.1 54.48,9.41 v53.72,9.4 | 40.48,14.86 41.11,14.22 C16.+ | JP9.2 41.4,8 42.8,6.6 45.21,6.6 46.1,7.49 51.69,7.49 52.32,8.13 52.32,9.4
  Top 0.61: v36.36,26.25 35.35,26.15 33.85,26.76 | C_BYP_MCU1.1 40.48,14.86 43.31,14.86 48.26,9.91 51.56,9.91 52.07,9.4 52.32,9.4 v53.72,9.4
  Bottom 0.305: v53.72,9.4 53.86,9.38 C11.1
  Bottom 0.406: L_AVCC.2 29.51,18.88 v30.23,18.41 | U$12.8 55.89,9.91 C11.1 | R41.2 23.5,12.28 U$17.8 23.5,15.37 | C10.1 23.5,15.37 | 23.5,15.37 23.5,17.14 v23.75,17.14 | C14.1 36.96,25.15 36.96,25.82 | C18.+ 32.93,20.95 v32.26,20.95 | C12.1 43.16,18.54 v41.91,18.54
  Bottom 0.61: 37.38,25.82 36.96,25.82 36.23,25.82 v37.38,26.25 v36.36,26.25
  pour Top (isolate 0.305): 17.4,46.23 51.82,46.23 53.34,44.7 53.34,37.59 50.55,34.8 48.9,34.8 45.97,31.88 45.97,10.16 44.2,8.38 34.67,8.38 30.35,12.7 30.35,17.02 30.35,24.77 28.83,26.29 24.51,26.29 23.88,25.65 23.88,22.1 23.88,21.34 23.5,20.95 19.94,20.95 19.43,21.46 19.43,24.89 17.91,26.42 7.87,26.42 6.1,28.19 6.1,35.31 6.48,35.69 12.19,35.69 17.4,40.89
+5V/2
  Top 0.305: 9.4,13.19 IC3.1 11.48,13.19 C6.1 | 9.4,13.19 IC3.5 | IC1.5 IC1.1 11.48,20.05 C1.1 11.68,20.07 9.4,20.07 9.4,16.62 | C7.1 11.48,16.62 IC2.1 9.4,16.62 | 9.4,16.62 IC2.5 9.31,16.64 9.4,15.62 9.4,13.19 | IC4.5 9.4,9.76 | C5.1 11.48,9.76 IC4.1 9.4,9.76 | 9.4,9.76 9.4,13.19 | U$13.OUT 9.27,8.13 9.4,9.76
  Top 0.406: SV6.3 SV6.4 | SV7.3 SV7.4
  Top 0.61: SV7.3 4.83,10.79 5.33,9.78 6.35,8
  Top 1.27: 6.35,8 6.73,7.75 U$13.OUT
  pour Top (isolate 0.305): 0.76,22.35 4.83,22.35 5.71,21.97 5.71,7.87 4.95,7.11 1.02,7.11 0,8.13 0,22.1
  pour Top (isolate 0.305): 6.73,7.37 6.73,21.21 7.62,22.1 11.81,22.1 12.19,21.72 12.19,7.37 12.32,7.24 6.86,7.24
+5V/3
  Top 0.406: R_LDO_OUT1.2 10.79,41.11 U$16.OUT SER_PWR_P_PU1.2 | U$6.2 8.26,40.26
  Top 0.813: 8.26,40.26 8.51,40.64 U$16.OUT
+5V/4
  Top 0.305: U$6.4 7.3,35.94 7.87,35.31 9.65,35.31 9.65,34.16 | IC5.1 9.97,28.01 9.65,28.32 9.65,34.16 | IC6.1 9.59,34.1 9.65,34.16
  Top 0.406: 4.06,36.32 3.56,36.83 LED1.A
  Top 0.61: U$6.4 6.63,36.32 4.06,36.32 4.06,35.56 SV8.7
+12V  (via drill 0.6)
  Top 0.254: SER_PWR_P_PU.2 19.68,4.74 v19.68,6.22
  Top 0.406: U$7.2 v14.8,24.13 17.23,24.26 SER_PWN_N_PD4.1 | SV8.3 4.95,29.46 4.95,29.08 7.87,26.16 12.57,26.16 12.95,26.54 v13.08,26.54
  Top 0.61: U$4.2 19.68,6.73 | 19.68,6.73 v19.68,7.24 | v19.68,6.22 19.68,6.73
  Bottom 0.305: 16.32,25.27 16.7,25.27 16.32,25.78
  Bottom 0.406: v13.08,26.54 13.46,25.91 16.26,25.91 | 16.26,25.91 16.32,25.91 | v14.8,24.13 16.26,24.32 16.26,25.91
  Bottom 0.61: U$17.3 U$17.4 v19.68,7.24 v19.68,6.22
  Bottom 1.778: U$16.IN 16.26,40.26 16.32,25.91 16.32,25.78 16.32,25.27 16.26,10.92 18.49,7.92 U$17.4
AVCC  (via drill 0.6)
  Top 0.305: C3.1 26.24,22.38 26.71,22.44 | 28.2,22.95 C_AVCC.1
  Top 0.406: U4.39 29.5,24.22 29.16,23.88 29.07,23.58 28.64,23.15 28.34,23.15 C_AVCC.1 28.15,22.95 | 26.71,22.44 28.2,22.95 | v27.18,21.97 26.45,22.23 C3.1
  Bottom 0.406: L_AVCC.1 28.11,21.37 v27.18,21.97
BATT_VOLT_SIG
  Top 0.305: R7.1 30.61,12.96 33.03,15.38 U4.2
  Top 0.406: R6.1 28.69,9.83 R7.1
BATTERY
  Top 0.406: LED4.A JP6.1
  Bottom 1.27: JP6.1 55.24,22.99 U$15.P$2
BATTERY_VOLTAGE  (via drill 0.6)
  Top 0.406: R6.2 25.98,8.13 25.02,7.54 24.82,7.54 U$14.P$2
  Top 0.813: v23.37,5.97 U$14.P$2
  Top 1.27: v23.37,4.95 v22.35,4.95 v22.35,5.97 v23.37,5.97
  Bottom 0.61: U$17.2 U$17.1
  Bottom 0.813: U$17.1 22.73,6.99 v23.37,5.97 | v22.35,5.97 v22.35,4.95
  Bottom 1.27: v23.37,5.97 v22.35,5.97 | v22.35,4.95 v23.37,4.95
CPU_PWR_CTRL  (via drill 0.6)
  Top 0.254: SER_PWN_N_PD3.2 14.69,38.31 14.99,38.61 17.27,38.61 17.65,38.23 17.65,37.55 SER_PWN_N_PD2.2
  Top 0.305: U4.27 37.02,30.8 37.59,31.37 v37.97,31.62 | v31.11,36.45 29.97,36.45 v27.56,38.86 | v24.38,38.86 23.88,38.86 22.67,37.66 18.73,37.66 18.54,37.47 SER_PWN_N_PD2.2
  Bottom 0.305: v37.97,31.62 35.18,31.5 33.27,33.4 33.27,33.78 31.11,35.94 v31.11,36.45 | v27.56,38.86 v24.38,38.86
DEBUG_RX  (via drill 0.6)
  Top 0.406: U4.22 43.07,28.21 v43.56,28.7 | v42.42,31.62 42.42,33.02 49.4,40.01 49.91,40.01 SV9.11
  Bottom 0.406: v43.56,28.7 43.56,30.48 v42.42,31.62
DEBUG_TX
  Top 0.406: U4.23 40.22,30.82 41.27,32.38 41.27,33.4 48.9,41.02 48.9,41.53 SV9.9
GND  (via drill 0.6)
  Top 0.254: R24.2 57.19,30.61 v56.13,30.61 | v53.34,29.21 U$11.4 | R18.2 57.57,35.69 v54.48,35.69 | U$6.5 8.26,36.07 12.06,36.07 v12.45,35.69
  Top 0.305: 56.52,15.37 v53.85,15.37 | IC1.3 10.29,21.35 | C1.2 11.48,21.35 10.29,21.35 | C7.2 11.48,17.92 IC2.3 10.25,18.54 v10.41,18.67 | C5.2 11.48,11.06 IC4.3 10.41,11.06 v10.41,11.81 | 10.41,14.49 11.48,14.49 C6.2 | 10.29,21.35 v9.78,21.97 | IC3.3 10.41,14.49 | 10.41,14.49 v10.41,15.24 | C2.2 12.57,29.96 12.57,30.1 10.94,30.09 IC5.3 | IC6.3 8.19,32.2 v8,31.37 | 17.78,42.67 15.37,42.67 | U$16.GND 13.34,39.75 v13.46,39.5 | C3.2 25.84,24.69 | U4.38 30.52,24.98 v31.92,24.98 | C_BYP_MCU2.2 35.05,32.35 v35.05,33.27 | U$4.5 15.49,6.73 15.11,6.48 13.46,6.48 U$13.GND
  Top 0.406: U4.38 28.5,25.01 C_AVCC.2 25.84,24.69 | C_BYP_MCU2.2 34.63,31.04 U4.30 34.63,28.86 v35.05,28.45 | C_BYP_MCU3.2 43.62,25.01 U4.18 40.63,25.01 v40.39,24.77 | C_BYP_MCU1.2 37.84,17.52 U4.8 37.84,19.7 v37.47,20.07 | C_LDO_OUT1.2 20.02,40.6 U$2.1 18.62,42.47 17.78,42.67 17.78,43.05 C_LDO_IN1.2 17.36,42.67 15.37,42.67 U$16.GND | R13.2 57.57,13.55 56.52,13.55 56.52,15.37 | v53.85,15.37 U$5.4 | R3.2 57.87,20.54 57.28,21.21 54.74,21.21 v53.72,20.45 | SER_PWN_N_PD2.1 16.04,36.66 15.11,35.94 14.48,35.43 v14.1,35.43 14.08,35.43 C4.2 | IC5.3 12.7,30.03 v12.7,30.86 | U$7.5 v10.29,24.13 | R7.2 30.72,8.12 v32,8.13 | U$9.4 U$9.3 U$9.2 32.77,37.59 v32.26,37.08 | SER_PWN_N_PD.1 25.74,2.41 v27.05,2.41 | SV8.8 R45.1 | C13.2 v53.09,5.97
  Top 0.61: v18.16,41.15 U$2.1
  Bottom 0.254: v56.13,30.61 55.5,29.88 | 55.5,29.88 54.23,29.21 | v54.48,35.69 55.5,34.67 55.5,29.88 | v12.45,35.69 12.57,35.69 13.08,35.31 13.72,35.31 v14.1,35.43 | SV9.4 41.4,44.7 42.29,45.59 45.09,45.59 SV9.8 46.48,44.32 47.75,45.59 50.16,45.59 SV9.12 53.09,42.67 53.09,38.23 51.82,36.96 49.28,36.96 47.37,35.05 45.09,32.77 41.91,32.77 40.39,31.24 v40.39,24.77 | C12.2 43.43,20.94 43.43,22.48
  Bottom 0.305: v9.78,21.97 v10.41,18.67 v10.41,15.24 | v10.41,15.24 10.41,15.11 | v10.41,15.24 v10.41,11.81 10.41,11.43 9.08,10.1 | SV7.1 5.97,8.26 9.08,10.1 | U$13.GND 9.08,9.97 9.08,10.1 | v8,31.37 12.19,31.5 v12.7,30.86 | v13.46,39.5 13.46,35.56 13.72,35.31 | SV8.8 2.54,34.29 | 2.54,34.29 5.08,34.29 5.71,35.69 v12.45,35.69 | SV8.4 2.54,31.75 2.54,34.29 | C9.2 C8.2 25.29,26.29 31.88,26.29 31.92,26.25 v31.92,24.98 | v35.05,33.27 32.26,36.2 v32.26,37.08 | C11.2 54.86,7.62 54.74,7.51 49.78,7.51 49.64,7.51 48.9,8.26 48.9,9.27 49.66,10.03 51.69,10.03 | 53.09,11.43 53.21,11.56 53.21,15.37
  Bottom 0.406: v53.72,20.45 v53.85,15.37 53.21,15.37 53.09,11.43 51.69,10.03 47.12,10.03 47.12,22.61 47.37,35.05 52.96,35.31 53.59,28.19 | SV7.1 SV7.2 | SV6.2 SV6.1 4.57,16.38 v10.41,15.24 | v14.1,35.43 14.35,30.86 | 14.35,30.86 14.35,28.07 8.13,28.07 8.13,24.26 | v9.78,21.97 8.13,21.97 8.13,24.26 | v12.7,30.86 14.35,30.86 | v10.29,24.13 8.13,24.26 | v32,8.13 33.53,8.13 34.92,9.53 | 34.92,9.53 34.92,16.26 | 34.92,16.26 34.92,24.39 | 34.92,24.39 32.51,24.39 | 32.51,24.39 v31.92,24.98 | 34.92,24.39 35.18,22.1 36.72,20.89 | 36.72,20.89 v37.47,20.07 | v40.39,24.77 40.46,21.97 38.24,21.05 | 38.24,21.05 36.72,20.89 | v35.05,28.45 35.05,26.92 32.83,24.7 | 32.83,24.7 32.51,24.39 | C9.2 26.18,27.45 26.92,28.19 26.92,29.97 26.29,30.61 23.88,30.61 20.32,34.16 20.32,34.8 21.46,35.94 21.46,37.85 v18.16,41.15 | C11.2 55.12,6.99 56.01,6.1 U$12.5 U$12.4 | C10.2 19.68,15.37 U$17.5 19.68,18.29 24.89,18.29 24.89,16.26 34.92,16.26 | v32.26,37.08 32.64,37.47 SV2.6 | v27.05,2.41 28.57,3.94 JP4.1 | C17.- 45.09,33.02 45.09,32.77 | C14.2 36.67,20.92 38.24,21.05 | C18.- 32.83,25.25 32.83,24.7 | v53.09,5.97 49.78,7.51 | 34.92,9.53 37.08,11.68 C16.-
  Bottom 0.61: U$12.4 U$12.3 | 53.59,28.19 53.34,28.45 v53.34,29.21 54.23,29.21
  Bottom 1.27: JP7.1 63.12,6.78 U$12.4 | JP4.1 31.62,6.35 v32,8.13 | 47.12,22.61 46.86,22.48 43.43,22.48 41.27,22.48 40.39,23.37 v40.39,24.77
  other vias: 19.05,41.78
  pour Bottom (isolate 0.305): 61.98,0.13 4.7,0.13 0.13,4.7 0.13,41.91 4.7,46.48 14.73,46.48 15.49,45.72 15.49,40.77 16.26,40.01 17.14,40.89 17.14,45.59 17.91,46.35 26.16,46.35 27.05,45.47 27.05,43.69 27.43,43.31 27.94,43.31 28.07,43.43 28.07,45.59 28.83,46.35 51.94,46.35 53.47,44.83 53.47,39.12 57.02,35.56 57.02,28.83 55.88,27.69 54.48,27.69 53.34,26.54 53.34,24.77 52.32,24.77 51.18,23.62 51.18,22.23 52.07,21.34 53.47,21.34 53.59,21.21 53.59,21.08 54.36,20.32 56.26,20.32 57.53,19.05 57.53,12.19 59.31,10.41 59.31,9.14 61.09,7.37 62.23,7.37 62.61,6.99 62.61,0.76
MOT_PWR_GND
  Top 0.406: U$3.5 R15.1 | R15.2 U$1.5 | U$8.5 R26.2 | U$10.5 R26.1
  Bottom 0.406: 64.9,16.51 R15.2 64.9,18.55 D5.A
  Bottom 0.61: SV3.2 64.9,15.11 | U$12.1 U$12.2 | D7.A 65.03,10.57 64.66,10.81 | D11.A 64.64,25.78 64.9,26.04
  Bottom 0.813: 64.9,30.99 64.9,30.73
  Bottom 1.27: 64.9,23.11 64.9,26.04 R26.1 64.9,30.73 | 64.9,23.11 64.9,16.51 64.9,15.11 R15.1 64.77,12.37 64.66,10.81 U$12.1 | SV4.2 64.9,30.99 R26.2 64.9,35.82 D9.A 64.64,36.32 64.64,38.1 JP5.1 | JP5.2 JP5.1 | JP5.1 62.74,40.01 | JP8.1 JP8.2 70.36,24.89 68.58,23.11 64.9,23.11
  pour Bottom (isolate 0.305): 64.01,37.59 71.63,37.59 72.14,37.08 72.14,9.4 71.37,8.64 61.21,8.64 60.33,9.53 60.33,12.7 60.96,13.34 63.12,13.34 63.75,13.97 63.75,37.34
N$1
  Top 0.254: U$5.1 57.32,16.38 R5.2 R9.2 55.79,18.16 R30.2
N$2
  Top 0.254: SER_PWR_P_PU.1 17.08,4.55 17.08,6.03
  Top 0.305: SER_PWR_P_R.2 17.61,10.88 17.14,10.41 17.14,6.1 17.08,6.03 16.83,5.78 U$4.6
N$3
  Top 0.305: U$4.3 18.37,7.74 SER_PWR_P_R.1
N$4
  Top 0.305: R_LDO_OUT.1 22.23,39.37 20.45,39.37 C_LDO_OUT1.1
N$5
  Top 0.254: U4.4 34.63,14.01 35.31,13.34 35.31,9.53 JP9.4
N$6
  Top 0.813: JP1.1 U$14.P$1
N$7
  Top 0.254: U$4.1 18.29,5.74 18.29,3.21 19.3,2.2 19.3,2.16 SER_PWN_N_PD1.1
N$8
  Top 0.406: D1.C 21.59,44.8 U$2.3 20.83,44.66 C_LDO_IN1.1 17.18,44.2 R_LDO_OUT1.1
N$9
  Top 0.254: U$6.6 9.21,37.12
  Top 0.305: SER_PWR_P_R1.2 6.39,38.01 6.48,38.1 8.89,38.1 9.21,37.78 U$6.6
  Top 0.406: 9.21,37.12 SER_PWR_P_PU1.1
N$10
  Top 0.305: SER_PWR_P_R1.1 6.03,39.2 U$6.3
N$11
  Top 0.254: U$5.2 55.37,14.1 55.37,10.92 55.88,10.79 | 55.88,10.79 57.32,10.79 R11.1 58.46,10.38 60.45,10.29 R12.2 | R31.2 53,10.79 55.88,10.79
N$12
  Top 0.254: R4.2 54.1,18.03 55.24,19.18 59.6,19.18 | 59.65,19.56 R3.1 59.6,19.18 | U$1.1 61.15,18.6 60.83,19.18 59.6,19.18
N$13
  Top 0.254: R5.1 61.06,16.51 U$1.3
N$14
  Top 0.254: R10.2 56.13,11.94 56.64,12.45 58.93,12.45 R13.1 59.86,13.5 60.2,13.46 60.94,13.46 U$3.1
N$15
  Top 0.254: R11.2 60.16,11.56 60.45,11.56 61.15,11.62 U$3.3
N$16
  Top 0.254: U4.5 35.45,14.21 36.32,13.34 36.32,11.05 36.96,10.41 38.23,10.41 38.86,9.78 JP9.3
N$17
  Top 0.406: U$1.4 63.81,16.7 64.39,16.38 66.17,16.38 66.93,16.89 67.18,16.89 | 67.18,16.89 SV3.1 68.07,18.41 D2.A | U$1.6 63.81,18.6 64.39,18.92 65.91,18.92 66.93,18.16 66.93,17.14 67.18,16.89
  Bottom 0.406: D5.C 68.32,17.65 SV3.1
N$18
  Top 0.305: IC1.4 7.84,22.06 R32.1
N$19
  Top 0.406: U$3.6 63.46,13.67 | U$3.4 63.71,11.47 64.26,11.18 65.66,11.18 66.93,12.57 SV3.3 68.58,11.17 D6.A
  Top 0.61: 63.46,13.67 64.14,13.97 65.66,13.97 66.93,12.57
  Bottom 0.406: D7.C 68.58,11.17 SV3.3
N$20
  Top 0.254: R17.2 54.99,33.53 56.9,33.53 57.06,34.92 60.07,34.92 | 60.07,34.92 60.58,34.92 60.9,34.6 U$8.1 | R18.1 60.07,35.52 60.07,34.92
N$21
  Top 0.254: R19.1 60.03,32.38 60.2,32.38 60.52,32.7 U$8.3
N$22
  Top 0.254: R20.2 R19.2 57.7,31.75 55.5,31.75 | U$11.1 55.24,31.62 55.5,31.75 | 55.5,31.75 R28.2
N$23
  Top 0.254: R20.1 59.91,33.66 U$8.2 62.36,33.66 | 62.36,33.66 R25.1 62.36,28.57 | 62.36,33.66 R25.2 | U$10.2 62.36,28.57 | 62.36,28.57 62.36,26.29 62.45,26.29 R23.1 | R9.1 59.44,18.54 60.33,17.65 U$1.2 | R12.1 62.57,9.87 62.36,10.29 62.36,12.45 62.23,12.57 U$3.2
  Top 0.406: 62.45,36.16 R25.2 | 62.23,12.57 62.36,12.7 R14.1 62.36,17.53 62.23,17.65 U$1.2 | R12.1 64.39,9.65 D6.C | D2.C 62.61,20.45 R14.2 62.36,22.99 62.36,23.07 62.23,23.07 | 62.23,23.07 62.19,23.07 R23.1 | R27.1 62.23,22.99 62.23,23.07
  Top 0.61: R25.2 D8.C | D10.C R23.1
  Top 1.27: JP8.3 69.85,22.35 69.09,23.11 62.48,23.11 62.36,22.99
  Bottom 0.406: 62.36,23.71 61.85,23.33 U$15.P$1
  Bottom 1.016: 62.36,23.71 R14.2 R14.1
  Bottom 1.27: R25.2 61.85,36.2 | 61.85,36.2 61.85,14.86 62.36,14.86 R25.1 | JP5.3 57.78,39.12 60.45,36.2 61.85,36.2
  pour Top (isolate 0.305): 64.01,37.72 71.5,37.72 72.01,37.21 72.01,9.02 71.5,8.51 61.59,8.51 61.21,8.89 61.21,37.08 61.85,37.72
N$24
  Top 0.254: 6.35,33.15 R1.2
  Top 0.305: IC6.2 6.35,33.15
N$25
  Top 0.254: R23.2 59.6,26.67 58.8,26.67 57.95,27.52 R22.1 57.57,28.19 U$11.2 54.19,27.9 R29.2
N$26
  Top 0.254: U$10.1 59.72,29.52 R24.1 59.65,29.3 59.18,28.83 56.35,28.83 R21.2
N$27
  Top 0.254: R22.2 59.97,27.62 U$10.3
N$28
  Top 0.406: LED4.C R27.2
N$29
  Top 0.61: U$8.6 63.81,34.6 64.26,35.05 65.53,35.05 66.8,33.78 | 66.8,33.78 67.44,33.78 SV4.1 68.32,34.16 D8.A | U$8.4 63.81,32.7 64.26,32.26 65.53,32.26 66.55,33.27 66.55,33.66 66.8,33.78
  Bottom 0.61: D9.C 68.32,34.16 SV4.1
N$30
  Top 0.406: D10.A 67.69,25.79
  Top 0.61: 67.69,25.79 SV4.3 66.93,28.32 | U$10.4 63.81,27.62 64.26,27.18 65.66,27.18 66.93,28.32 | U$10.6 63.81,29.52 64.26,29.97 65.53,29.97 66.93,28.7 66.93,28.32
  Bottom 0.406: SV4.3
  Bottom 0.61: SV4.3 D11.C
N$31
  Top 0.305: IC2.4 7.11,16.61 R33.1
N$32
  Top 0.305: IC3.4 8.35,14.69 R34.1
N$33
  Top 0.305: IC4.4 7.05,9.69 R35.1
N$34
  Top 0.254: IC1.2 R36.2
N$35
  Top 0.254: IC2.2 R37.2
N$36
  Top 0.254: R38.2 IC3.2
N$37
  Top 0.254: IC4.2 R39.2
N$38
  Top 0.305: R32.2 6.99,20.49 6.6,20.57 5.8,21.34 SV6.5
N$39
  Top 0.305: R33.2 6.6,18.29 6.57,18.8 5.33,20.07 3.17,20.07 SV6.6
N$40
  Top 0.305: R34.2 6.69,12.95 6.35,13.34 SV7.5
N$41
  Top 0.305: R35.2 6.9,11.43 6.35,11.43 5.71,12.06 3.17,12.06 SV7.6
N$42
  Top 0.254: U$6.1 9.97,37.97 12.1,37.97 SER_PWN_N_PD3.1
N$43
  Top 0.61: U$4.4 14.73,7.68 U$13.IN
N$44
  Top 0.305: U4.36 29.2,26.61 27.56,27.18 23.5,27.18 21.97,28.83 Q1.1
  Bottom 0.406: C9.1 Q1.1
N$45
  Top 0.305: U4.37 29.21,25.82 27.69,26.29 23.5,26.29 21.97,24.77 Q1.2
  Bottom 0.305: C8.1 24.78,24.38
  Bottom 0.406: 24.78,24.38 Q1.2
N$46
  Top 0.254: IC5.2 14.35,28.96 R2.2
N$47
  Top 0.305: R40.1 8.35,30.06 IC5.4
N$48
  Top 0.305: IC6.4 12.32,32.2 R8.1
N$49  (via drill 0.6)
  Top 0.305: R42.2 v59.31,7.37
  Bottom 0.305: v59.31,7.37 U$12.6
N$50
  Top 0.406: U$7.3 14.5,25.91 SER_PWN_N_PD5.1
N$51  (via drill 0.6)
  Top 0.305: SER_PWN_N_PD4.2 18.29,26.5 v18.29,31.62 | v19.3,36.7 v23.75,36.7 | v28.19,36.32 29.21,35.43 32.77,35.43 U$9.1
  Top 0.406: SER_PWN_N_PD4.2 17.69,26.04 SER_PWN_N_PD5.2
  Bottom 0.305: v18.29,31.62 18.29,35.69 v19.3,36.7 | v23.75,36.7 26.29,36.7 26.67,36.32 v28.19,36.32
N$52  (via drill 0.6)
  Top 0.305: U$7.1 14.37,23.11 19.3,23.11 19.3,32 20.19,32.64 v24.77,32.64 | v27.3,37.34 27.18,37.08 27.18,35.56 28.83,34.54 35.69,34.54 35.81,34.42 SER_PWN_N_PD6.1
  Bottom 0.305: v24.77,32.64 22.86,34.16 22.86,37.34 23.24,37.72 27.05,37.72 27.05,37.59 v27.3,37.34
N$53
  Top 0.406: LED1.C 3.33,39.33 R45.2
N$54
  Bottom 0.406: R41.1 20.95,10.58 U$17.6
OC0AHS
  Top 0.254: SV1.2 48.77,14.35 | 48.77,14.35 U$5.3 | U4.11 40.22,18.07 40.78,17.52 42.04,17.14 44.58,17.14 48.77,14.35
  Top 0.406: R31.1 53.09,12.79 53.09,14.22 U$5.3
OC0ALS
  Top 0.254: R10.1 50.8,11.94 SV1.1 48.77,11.68 44.07,16.13 42.29,16.13 40.19,16.98 39.44,17.6 U4.10
OC0BHS
  Top 0.254: 52.96,19.3 SV1.4 50.04,19.3 49.78,19.81 43.38,20.84 42.95,21.02 U4.13 | 52.96,19.3 54.1,19.3 55.08,20.03 R30.1 | 52.96,19.3 53.47,18.8 53.47,16.64 U$5.5
OC0BLS
  Top 0.254: R4.1 51.98,17.65 SV1.3 48.64,17.27 45.97,18.03 U4.12
OC0CHS
  Top 0.254: U4.15 46.12,22.62 48.51,27.18 49.15,28.07 SV5.2 49.91,28.19 U$11.3 52.49,28.16 R29.1
OC0CLS
  Top 0.254: U4.14 44.01,21.83 46.61,21.84 49.02,25.53 SV5.1 54.99,25.53 R21.1
OC0DHS
  Top 0.254: 48.64,33.15 SV5.4 49.15,33.15 50.29,33.27 53,33.27 53.21,32.93 | 53.21,32.93 53.21,30.86 52.32,30.48 U$11.5 | R28.1 55.66,34.16 54.61,34.16 53,33.19 53.21,32.93
  Top 0.305: 48.64,33.15 47.75,32.38 45.97,25.91 45.43,24.22 U4.17
OC0DLS
  Top 0.254: SV5.3 50.55,30.61 R17.1
  Top 0.305: SV5.3 48.26,30.23 47.75,27.69 45.78,23.43 U4.16
PDI  (via drill 0.6)
  Top 0.305: U4.34 30.45,28.21 v28.92,29.73
  Bottom 0.305: v28.92,29.73 29.34,29.86 29.34,30.48 29.3,37.32 28.83,37.97 28.83,42.29 SV2.1
PWR_EXT1
  Top 0.406: U$7.4 11.15,25.25 7.24,25.25 4.57,27.94 SV8.1
PWR_EXT2
  Top 0.406: U$7.6 11.28,23.11 9.4,23.11 8.38,24.13 6.1,24.13 3.81,26.42 2.29,26.42 1.27,27.43 SV8.2
PWR_EXT_CTRL1
  Top 0.305: U$9.5 39.5,35.56 40.01,35.05 40.01,32.38 39.44,30.8 U4.24
PWR_EXT_CTRL2
  Top 0.305: SER_PWN_N_PD6.2 39.12,34.12 39.12,32 38.62,30.75 U4.25
RESET  (via drill 0.6)
  Top 0.305: U4.35 29.44,27.42 v28.44,28.17
  Top 0.406: R_PURESET.1 34.96,43.56 SV2.5
  Bottom 0.305: v28.44,28.17 28.65,28.39 30.06,28.77 30.05,30.41 30.02,38.39 31.37,39.62 31.37,42.29 SV2.5
RX_EXT
  Top 0.305: R1.1 4.74,34.29 2.54,34.29 SV8.6
RX_EXT_PIN  (via drill 0.6)
  Top 0.305: U4.32 33.03,30.85 30.48,33.4 29.08,33.4 v28.07,33.78 | v24.64,35.69 18.63,35.69 14.57,32.38 R8.2
  Bottom 0.305: v28.07,33.78 v24.64,35.69
SCL  (via drill 0.6)
  Top 0.305: U4.29 35.45,30.75 36.32,31.88 36.32,32.51 v36.58,32.89 | v36.83,36.83 36.83,39.62 | 36.83,39.62 SV9.1 | R44.2 35.85,39.62 36.83,39.62
  Bottom 0.305: v36.58,32.89 36.58,36.45 v36.83,36.83
SDA  (via drill 0.6)
  Top 0.305: U4.28 36.23,30.77 37.08,31.88 37.08,32 v37.97,32.89 | v37.97,37.72 37.97,38.73 38.61,39.37 | 38.61,39.37 39.5,40.26 40.01,40.26 SV9.3 | R43.2 38.61,39.28 38.61,39.37
  Bottom 0.305: v37.97,32.89 v37.97,37.72
SERVO1
  Top 0.254: 29.53,22.62 27.13,20.21
  Top 0.305: U4.41 29.53,22.62 | 27.13,20.21 17.25,20.21 15.49,20.7 15.37,20.7 15.33,20.74 R36.1
SERVO2
  Top 0.305: U4.42 29.64,21.83 27.4,19.59 17.36,19.59 15.37,17.53 15.24,17.4 15.07,17.31 R37.1
SERVO3
  Top 0.305: U4.43 29.73,21.02 27.67,18.96 18.11,18.96 18.03,18.92 15.37,13.97 R38.1
SERVO4
  Top 0.305: U4.44 27.96,18.33 18.6,18.33 17.91,16.64 15.37,10.29 15.2,10.29 R39.1
SERVO_PWR_CTRL
  Top 0.406: SER_PWN_N_PD1.2 SER_PWN_N_PD.2 23.91,2.83 24.51,3.43 25.65,3.43 28.57,6.35 33.66,6.35 34.29,6.99 34.29,13.08 33.85,13.52 U4.3
SIG_CPU_BATT_CURRENT  (via drill 0.6)
  Top 0.406: v22.23,16.76 22.86,16.13 30.99,16.13 32.25,17.39 U4.1
  Bottom 0.254: U$17.7 v22.23,16.76
SIG_MOTOR_CURRENT  (via drill 0.6)
  Top 0.305: 36.14,15.11 36.14,17.27 36.23,17.31 U4.6
  Top 0.406: v50.8,8.64 47.62,8.64 43.31,12.95 38.35,12.95 36.14,15.11
  Bottom 0.254: U$12.7 56.52,8.64 56.39,8.51 51.82,8.51
  Bottom 0.406: 51.82,8.51 51.18,8.51 v50.8,8.64
TX_EXT
  Top 0.305: R40.2 5.8,31.75 4.83,31.75 3.81,32.77 SV8.5
TX_EXT_PIN  (via drill 0.6)
  Top 0.305: U4.33 32.25,30.62 30.35,32.38 v28.32,32.38 | v23.75,34.67 23.5,34.67 23.37,34.8 18.92,34.8 15.62,32.13 15.62,29.88 R2.1
  Bottom 0.305: v28.32,32.38 27.05,32.64 26.29,33.27 v23.75,34.67

### Text on the board
_bsilk: - + - + - + | Rst NC PDI | Rx Tx NC NC SDA SCL | Gnd NC 3v3 | RobotBoard v4.0 / (c) Johannes Sulkakoski, 2015, GPLv2 / johannes.sulkakoski@systemlive.fi | Gd V+ S3 / Gd V+ S4 | Battery / Motor | Gd V+ S1 / Gd V+ S2 | Battery / CPU | Gnd | Gnd